# EAGLE schematic Lighting Schematic Design (EAGLE 9.1.3)
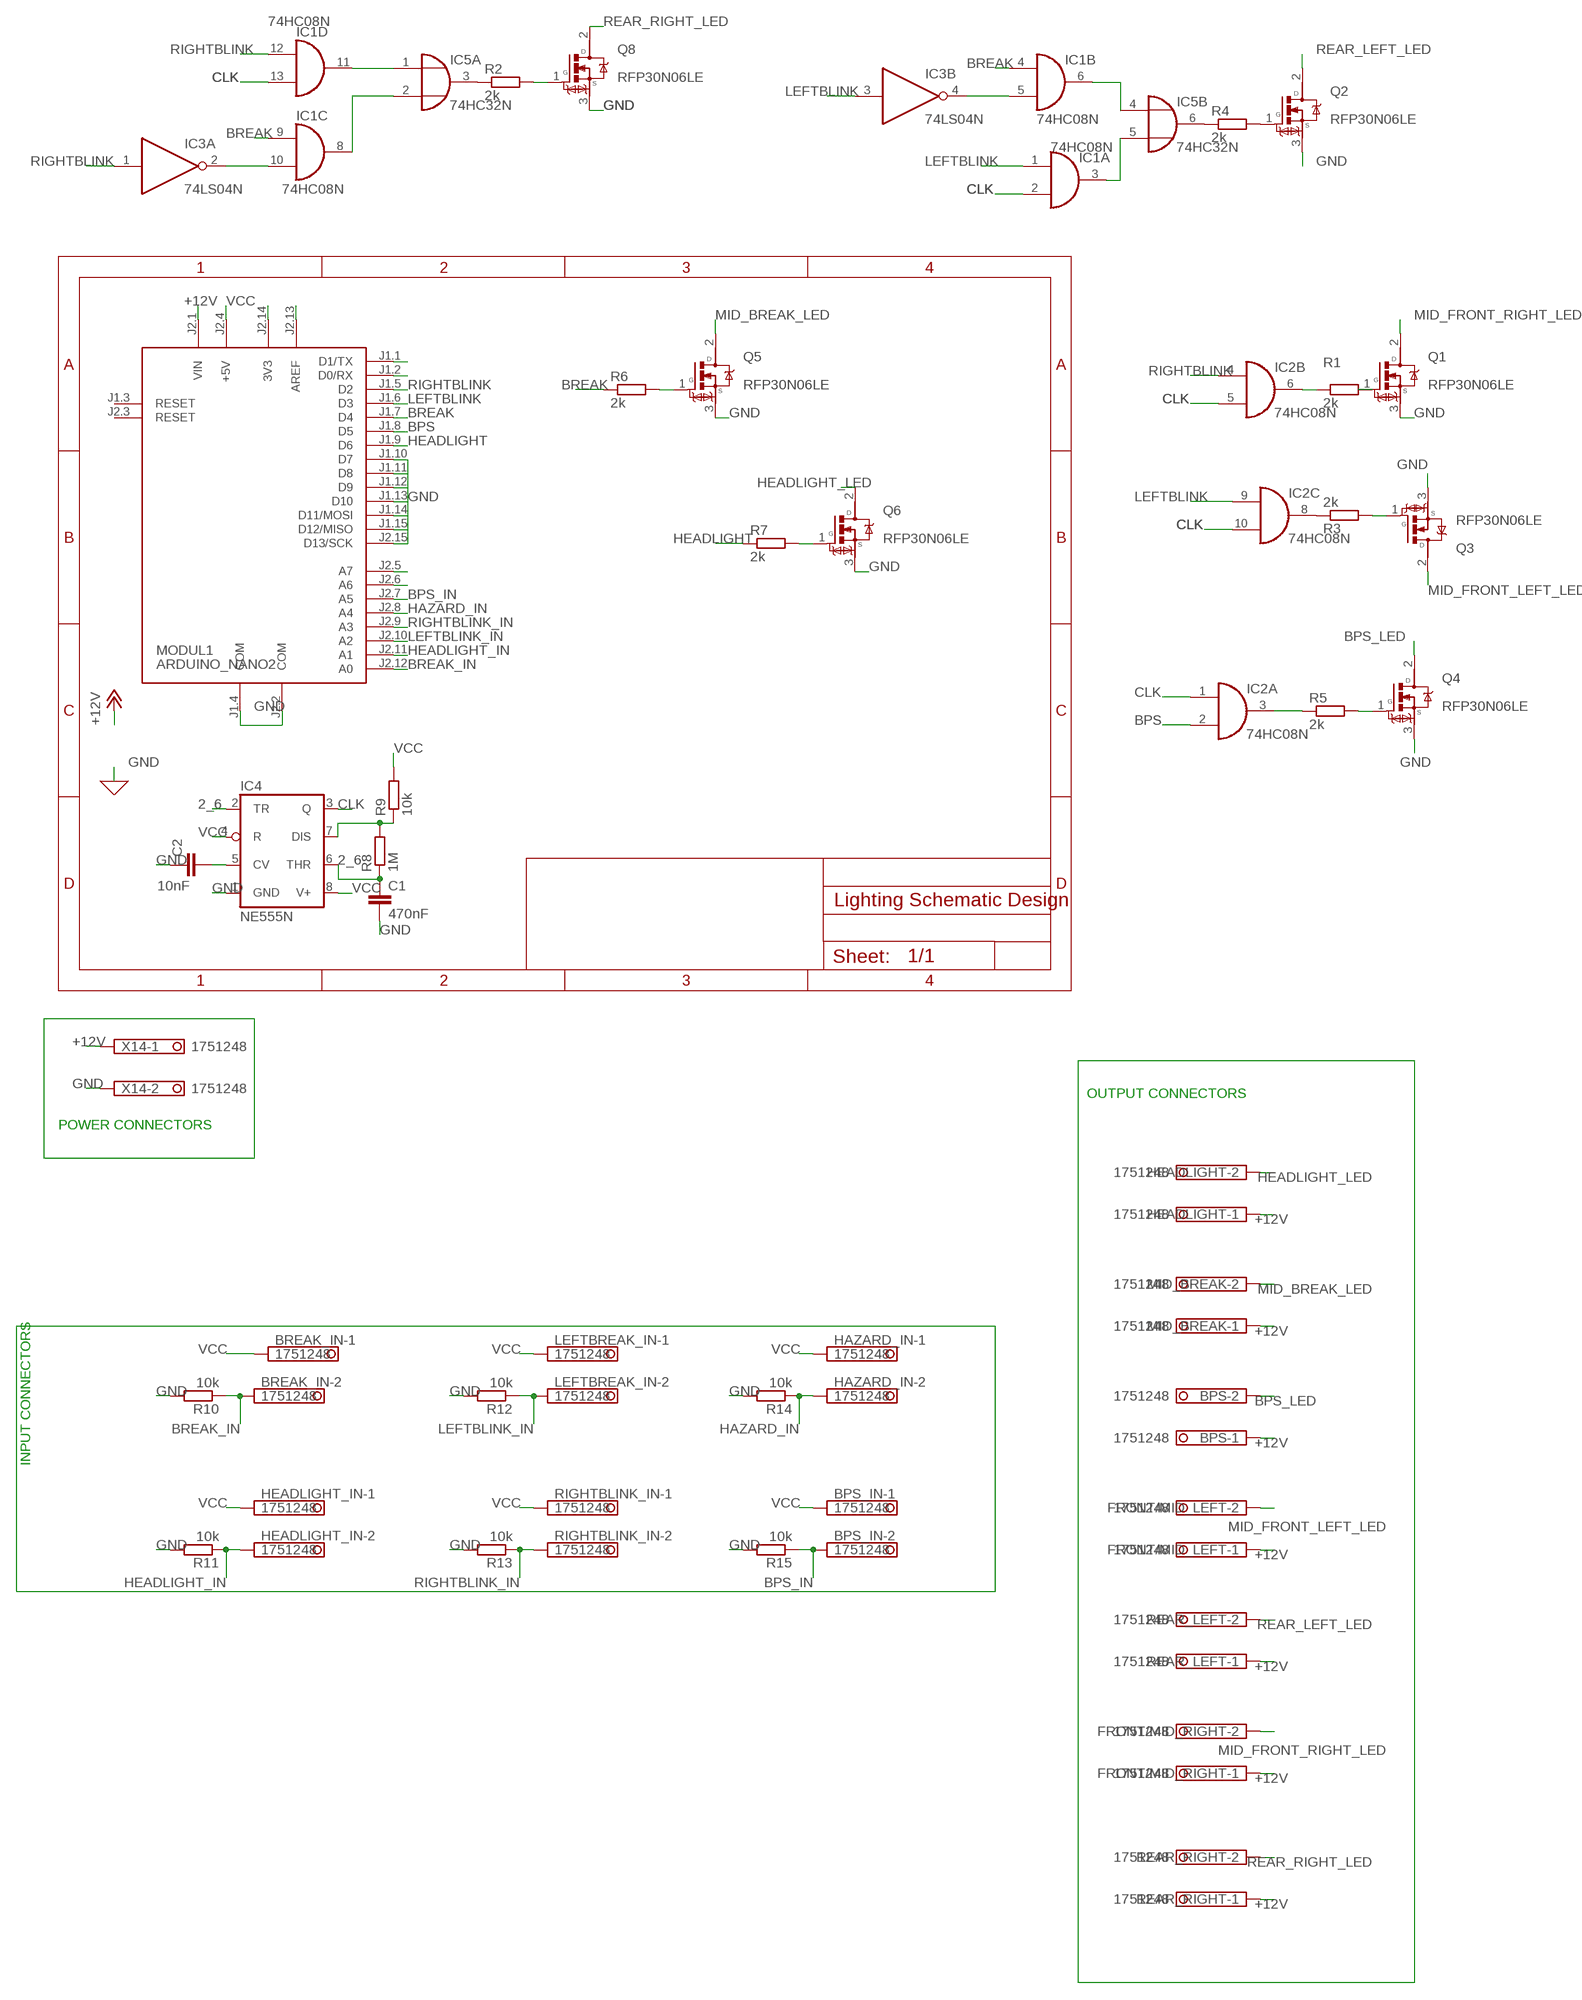
[diagram p0: schematic, sheet 1]

## Parts
BPS  1751248  [1751248]
BPS_IN  1751248  [1751248]
BREAK_IN  1751248  [1751248]
C1  470nF  C2.5/2  [C2.5-2]
C2  10nF  C2.5/2  [C2.5-2]
FRONT/MID_LEFT  1751248  [1751248]
FRONT/MID_RIGHT  1751248  [1751248]
HAZARD_IN  1751248  [1751248]
HEADLIGHT  1751248  [1751248]
HEADLIGHT_IN  1751248  [1751248]
IC1  74HC08N  [DIL14]
IC2  74HC08N  [DIL14]
IC3  74LS04N  [DIL14]
IC4  NE555N  [DIL08]
IC5  74HC32N  [DIL14]
LEFTBREAK_IN  1751248  [1751248]
MID_BREAK  1751248  [1751248]
MODUL1  ARDUINO_NANO2  [ARDUINO_NANO2]
Q1  RFP30N06LE  [TRANS_RFP30N06LE]
Q2  RFP30N06LE  [TRANS_RFP30N06LE]
Q3  RFP30N06LE  [TRANS_RFP30N06LE]
Q4  RFP30N06LE  [TRANS_RFP30N06LE]
Q5  RFP30N06LE  [TRANS_RFP30N06LE]
Q6  RFP30N06LE  [TRANS_RFP30N06LE]
Q8  RFP30N06LE  [TRANS_RFP30N06LE]
R1  2k  R-EU_0204/5  [0204/5]
R2  2k  R-EU_0204/5  [0204/5]
R3  2k  R-EU_0204/5  [0204/5]
R4  2k  R-EU_0204/5  [0204/5]
R5  2k  R-EU_0204/5  [0204/5]
R6  2k  R-EU_0204/5  [0204/5]
R7  2k  R-EU_0204/5  [0204/5]
R8  1M  R-EU_0204/5  [0204/5]
R9  10k  R-EU_0204/5  [0204/5]
R10  10k  R-EU_0204/5  [0204/5]
R11  10k  R-EU_0204/5  [0204/5]
R12  10k  R-EU_0204/5  [0204/5]
R13  10k  R-EU_0204/5  [0204/5]
R14  10k  R-EU_0204/5  [0204/5]
R15  10k  R-EU_0204/5  [0204/5]
REAR_LEFT  1751248  [1751248]
REAR_RIGHT  1751248  [1751248]
RIGHTBLINK_IN  1751248  [1751248]
X14  1751248  [1751248]

## Nets
2_6: C1.1 IC4.2(TR) IC4.6(THR) R8.1
+12V: BPS.1 FRONT/MID_LEFT.1 FRONT/MID_RIGHT.1 HEADLIGHT.1 MID_BREAK.1 MODUL1.J2.1(VIN) REAR_LEFT.1 REAR_RIGHT.1 X14.1
BPS: IC2.2(A:I1) MODUL1.J1.8(D5)
BPS_IN: BPS_IN.2 MODUL1.J2.7(A5) R15.1
BPS_LED: BPS.2 Q4.2(D)
BREAK: IC1.4(B:I0) IC1.9(C:I0) MODUL1.J1.7(D4) R6.1
BREAK_IN: BREAK_IN.2 MODUL1.J2.12(A0) R10.1
CLK: IC1.2(A:I1) IC1.13(D:I1) IC2.1(A:I0) IC2.5(B:I1) IC2.10(C:I1) IC4.3(Q)
GND: C1.2 C2.1 IC4.1(GND) MODUL1.J1.4(COM) MODUL1.J1.10(D7) MODUL1.J2.2(COM) MODUL1.J2.15(D13/SCK) Q1.3(S) Q2.3(S) Q3.3(S) Q4.3(S) Q5.3(S) Q6.3(S) Q8.3(S) R10.2 R11.2 R12.2 R13.2 R14.2 R15.2 X14.2
HAZARD_IN: HAZARD_IN.2 MODUL1.J2.8(A4) R14.1
HEADLIGHT: MODUL1.J1.9(D6) R7.1
HEADLIGHT_IN: HEADLIGHT_IN.2 MODUL1.J2.11(A1) R11.1
HEADLIGHT_LED: HEADLIGHT.2 Q6.2(D)
LEFTBLINK: IC1.1(A:I0) IC2.9(C:I0) IC3.3(B:I) MODUL1.J1.6(D3)
LEFTBLINK_IN: LEFTBREAK_IN.2 MODUL1.J2.10(A2) R12.1
MID_BREAK_LED: MID_BREAK.2 Q5.2(D)
MID_FRONT_LEFT_LED: FRONT/MID_LEFT.2 Q3.2(D)
MID_FRONT_RIGHT_LED: FRONT/MID_RIGHT.2 Q1.2(D)
N$1: Q8.1(G) R2.2
N$2: IC1.10(C:I1) IC3.2(A:O)
N$3: IC2.6(B:O) R1.1
N$4: IC1.5(B:I1) IC3.4(B:O)
N$5: IC4.7(DIS) R8.2 R9.1
N$6: Q2.1(G) R4.2
N$7: Q1.1(G) R1.2
N$8: Q3.1(G) R3.2
N$9: Q4.1(G) R5.2
N$10: IC2.3(A:O) R5.1
N$11: Q5.1(G) R6.2
N$12: Q6.1(G) R7.2
N$13: IC2.8(C:O) R3.1
N$17: IC5.3(A:O) R2.1
N$18: IC1.8(C:O) IC5.2(A:I1)
N$19: IC1.11(D:O) IC5.1(A:I0)
N$20: IC5.6(B:O) R4.1
N$21: IC1.6(B:O) IC5.4(B:I0)
N$22: IC1.3(A:O) IC5.5(B:I1)
N$28: MODUL1.J1.15(D12/MISO)
N$29: MODUL1.J1.14(D11/MOSI)
N$30: MODUL1.J1.13(D10)
N$31: MODUL1.J1.12(D9)
N$32: MODUL1.J1.11(D8)
N$34: C2.2 IC4.5(CV)
N$39: MODUL1.J1.2(D0/RX)
N$40: MODUL1.J1.1(D1/TX)
N$41: MODUL1.J2.5(A7)
N$42: MODUL1.J2.6(A6)
N$51: MODUL1.J2.14(3V3)
N$52: MODUL1.J2.13(AREF)
REAR_LEFT_LED: Q2.2(D) REAR_LEFT.2
REAR_RIGHT_LED: Q8.2(D) REAR_RIGHT.2
RIGHTBLINK: IC1.12(D:I0) IC2.4(B:I0) IC3.1(A:I) MODUL1.J1.5(D2)
RIGHTBLINK_IN: MODUL1.J2.9(A3) R13.1 RIGHTBLINK_IN.2
VCC: BPS_IN.1 BREAK_IN.1 HAZARD_IN.1 HEADLIGHT_IN.1 IC4.4(R) IC4.8(V+) LEFTBREAK_IN.1 MODUL1.J2.4(+5V) R9.2 RIGHTBLINK_IN.1
Unconnected: IC2.11(D:O) IC2.12(D:I0) IC2.13(D:I1) IC3.5(C:I) IC3.6(C:O) IC3.8(D:O) IC3.9(D:I) IC3.10(E:O) IC3.11(E:I) IC3.12(F:O) IC3.13(F:I) IC5.8(C:O) IC5.9(C:I0) IC5.10(C:I1) IC5.11(D:O) IC5.12(D:I0) IC5.13(D:I1) MODUL1.J1.3(RESET) MODUL1.J2.3(RESET)

## Notes on the sheet
- OUTPUT CONNECTORS
- POWER CONNECTORS
- INPUT CONNECTORS

## Power pins joined to a net without a drawn wire
GND: IC1.7(P:GND) IC2.7(P:GND) IC3.7(P:GND) IC5.7(P:GND)
VCC: IC1.14(P:VCC) IC2.14(P:VCC) IC3.14(P:VCC) IC5.14(P:VCC)

## Library data of the parts
BPS BPS_IN BREAK_IN FRONT/MID_LEFT FRONT/MID_RIGHT HAZARD_IN HEADLIGHT HEADLIGHT_IN LEFTBREAK_IN MID_BREAK REAR_LEFT REAR_RIGHT RIGHTBLINK_IN X14 = con-phoenix-350:1751248: MKDS 1/ 2-3,5 Printklemme Nennstrom: 10 A Bemessungsspannung: 160 V Raster: 3,5 mm Polzahl: 2 Montageart: Löten Anschlussart: Schraubanschluss Anschlussrichtung vom Leiter zur Platine: 0° Source: http://eshop.phoenixcontact.com .. 1751248.pdf; OC_FARNELL: unknown; OC_NEWARK: unknown
C1 C2 = capacitor-wima:C: CAPACITOR naming: grid - package width
IC1 IC2 = 74xx-eu:74*08: Quad 2-input AND gate
IC3 = 74xx-eu:74*04: Hex INVERTER
IC4 = linear:*555: TIMER
IC5 = 74xx-eu:74*32: Quad 2-input OR gate
MODUL1 = arduino:ARDUINO_NANO2: Arduino Nano2 Auto generated by modulcreator.ulp \;; ANZAHL: 2; MODUL: TRUE; STECKX0: -76200; STECKX1: 76200; STECKY0: 177800; STECKY1: 177800
Q1-Q6 Q8 = RFP30N06LE:RFP30N06LE: Mosfet n-Ch 60v 30a To-220ab - Rfp30n06le; AVAILABILITY: Unavailable; DESCRIPTION: MOSFET N-CH 60V 30A TO-220AB; MF: ON Semiconductor; MP: RFP30N06LE; PACKAGE: TO-220 Intersil; PRICE: None
R1-R15 = rcl:R-EU_: RESISTOR, European symbol; SPICEPREFIX: R